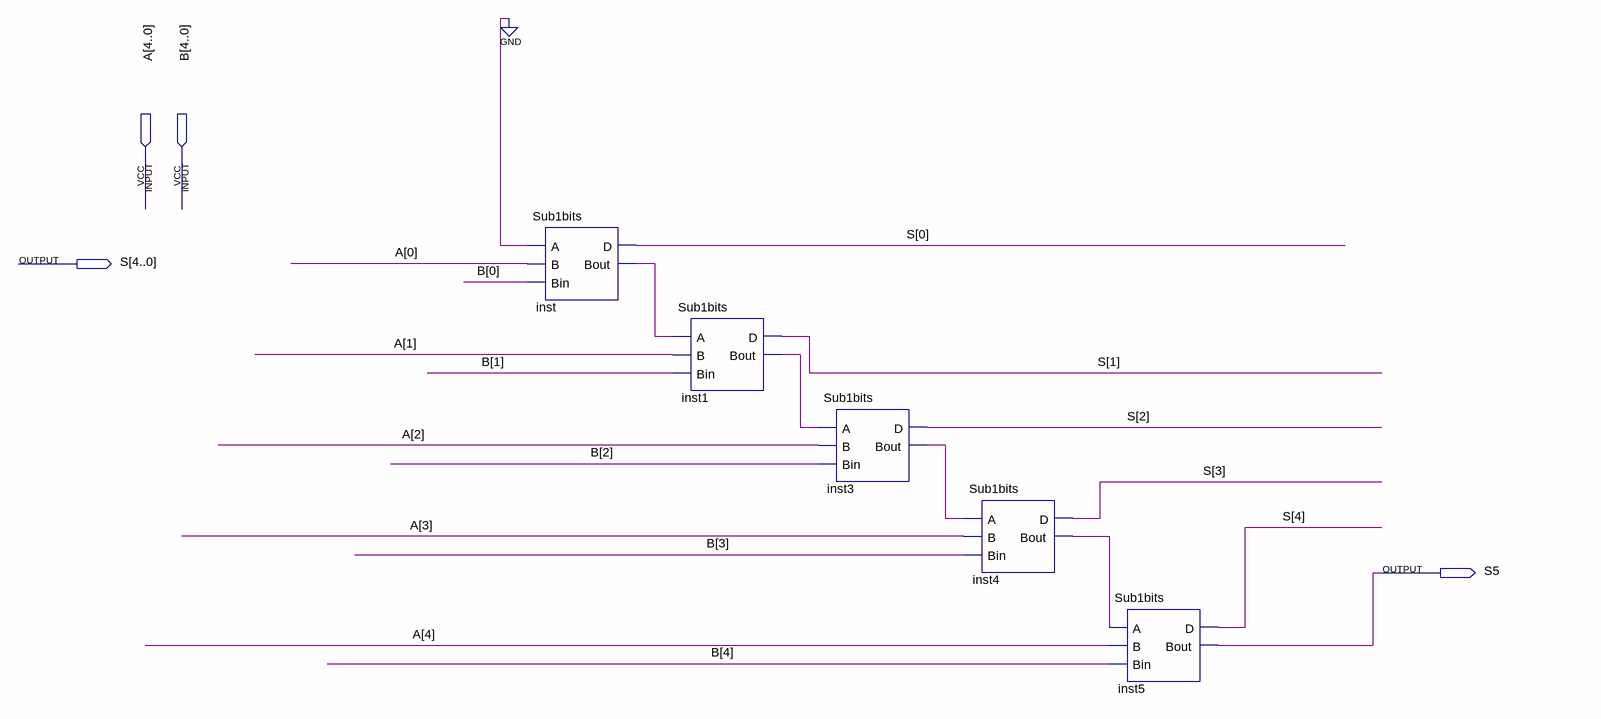
[diagram p0: schematic sheet]
// Quartus schematic Sub5bits.bdf as structural Verilog: 5 symbols, 4 pins
module Sub5bits (
  input  [4:0] A,
  input  [4:0] B,
  output [4:0] S,
  output S5
);

  wire inst1_bout, inst3_bout, inst4_bout, inst_bout;

  Sub1bits inst (.A(1'b0), .B(A[0]), .Bin(B[0]), .D(S[0]), .Bout(inst_bout));
  Sub1bits inst1 (.A(inst_bout), .B(A[1]), .Bin(B[1]), .D(S[1]), .Bout(inst1_bout));
  Sub1bits inst3 (.A(inst1_bout), .B(A[2]), .Bin(B[2]), .D(S[2]), .Bout(inst3_bout));
  Sub1bits inst4 (.A(inst3_bout), .B(A[3]), .Bin(B[3]), .D(S[3]), .Bout(inst4_bout));
  Sub1bits inst5 (.A(inst4_bout), .B(A[4]), .Bin(B[4]), .D(S[4]), .Bout(S5));
endmodule
